# EasyEDA Pro project 蓝牙鼠标.epro

# Schematic 体感式蓝牙鼠标
Board Name: 体感式蓝牙鼠标; Create Date: 2025-04-14; Page Name: P1; Project Name: 空中鼠标; Schematic Name: 体感式蓝牙鼠标; Update Date: 2025-04-24; Company: 嘉立创EDA; Page Size: A4; Version: V1.0
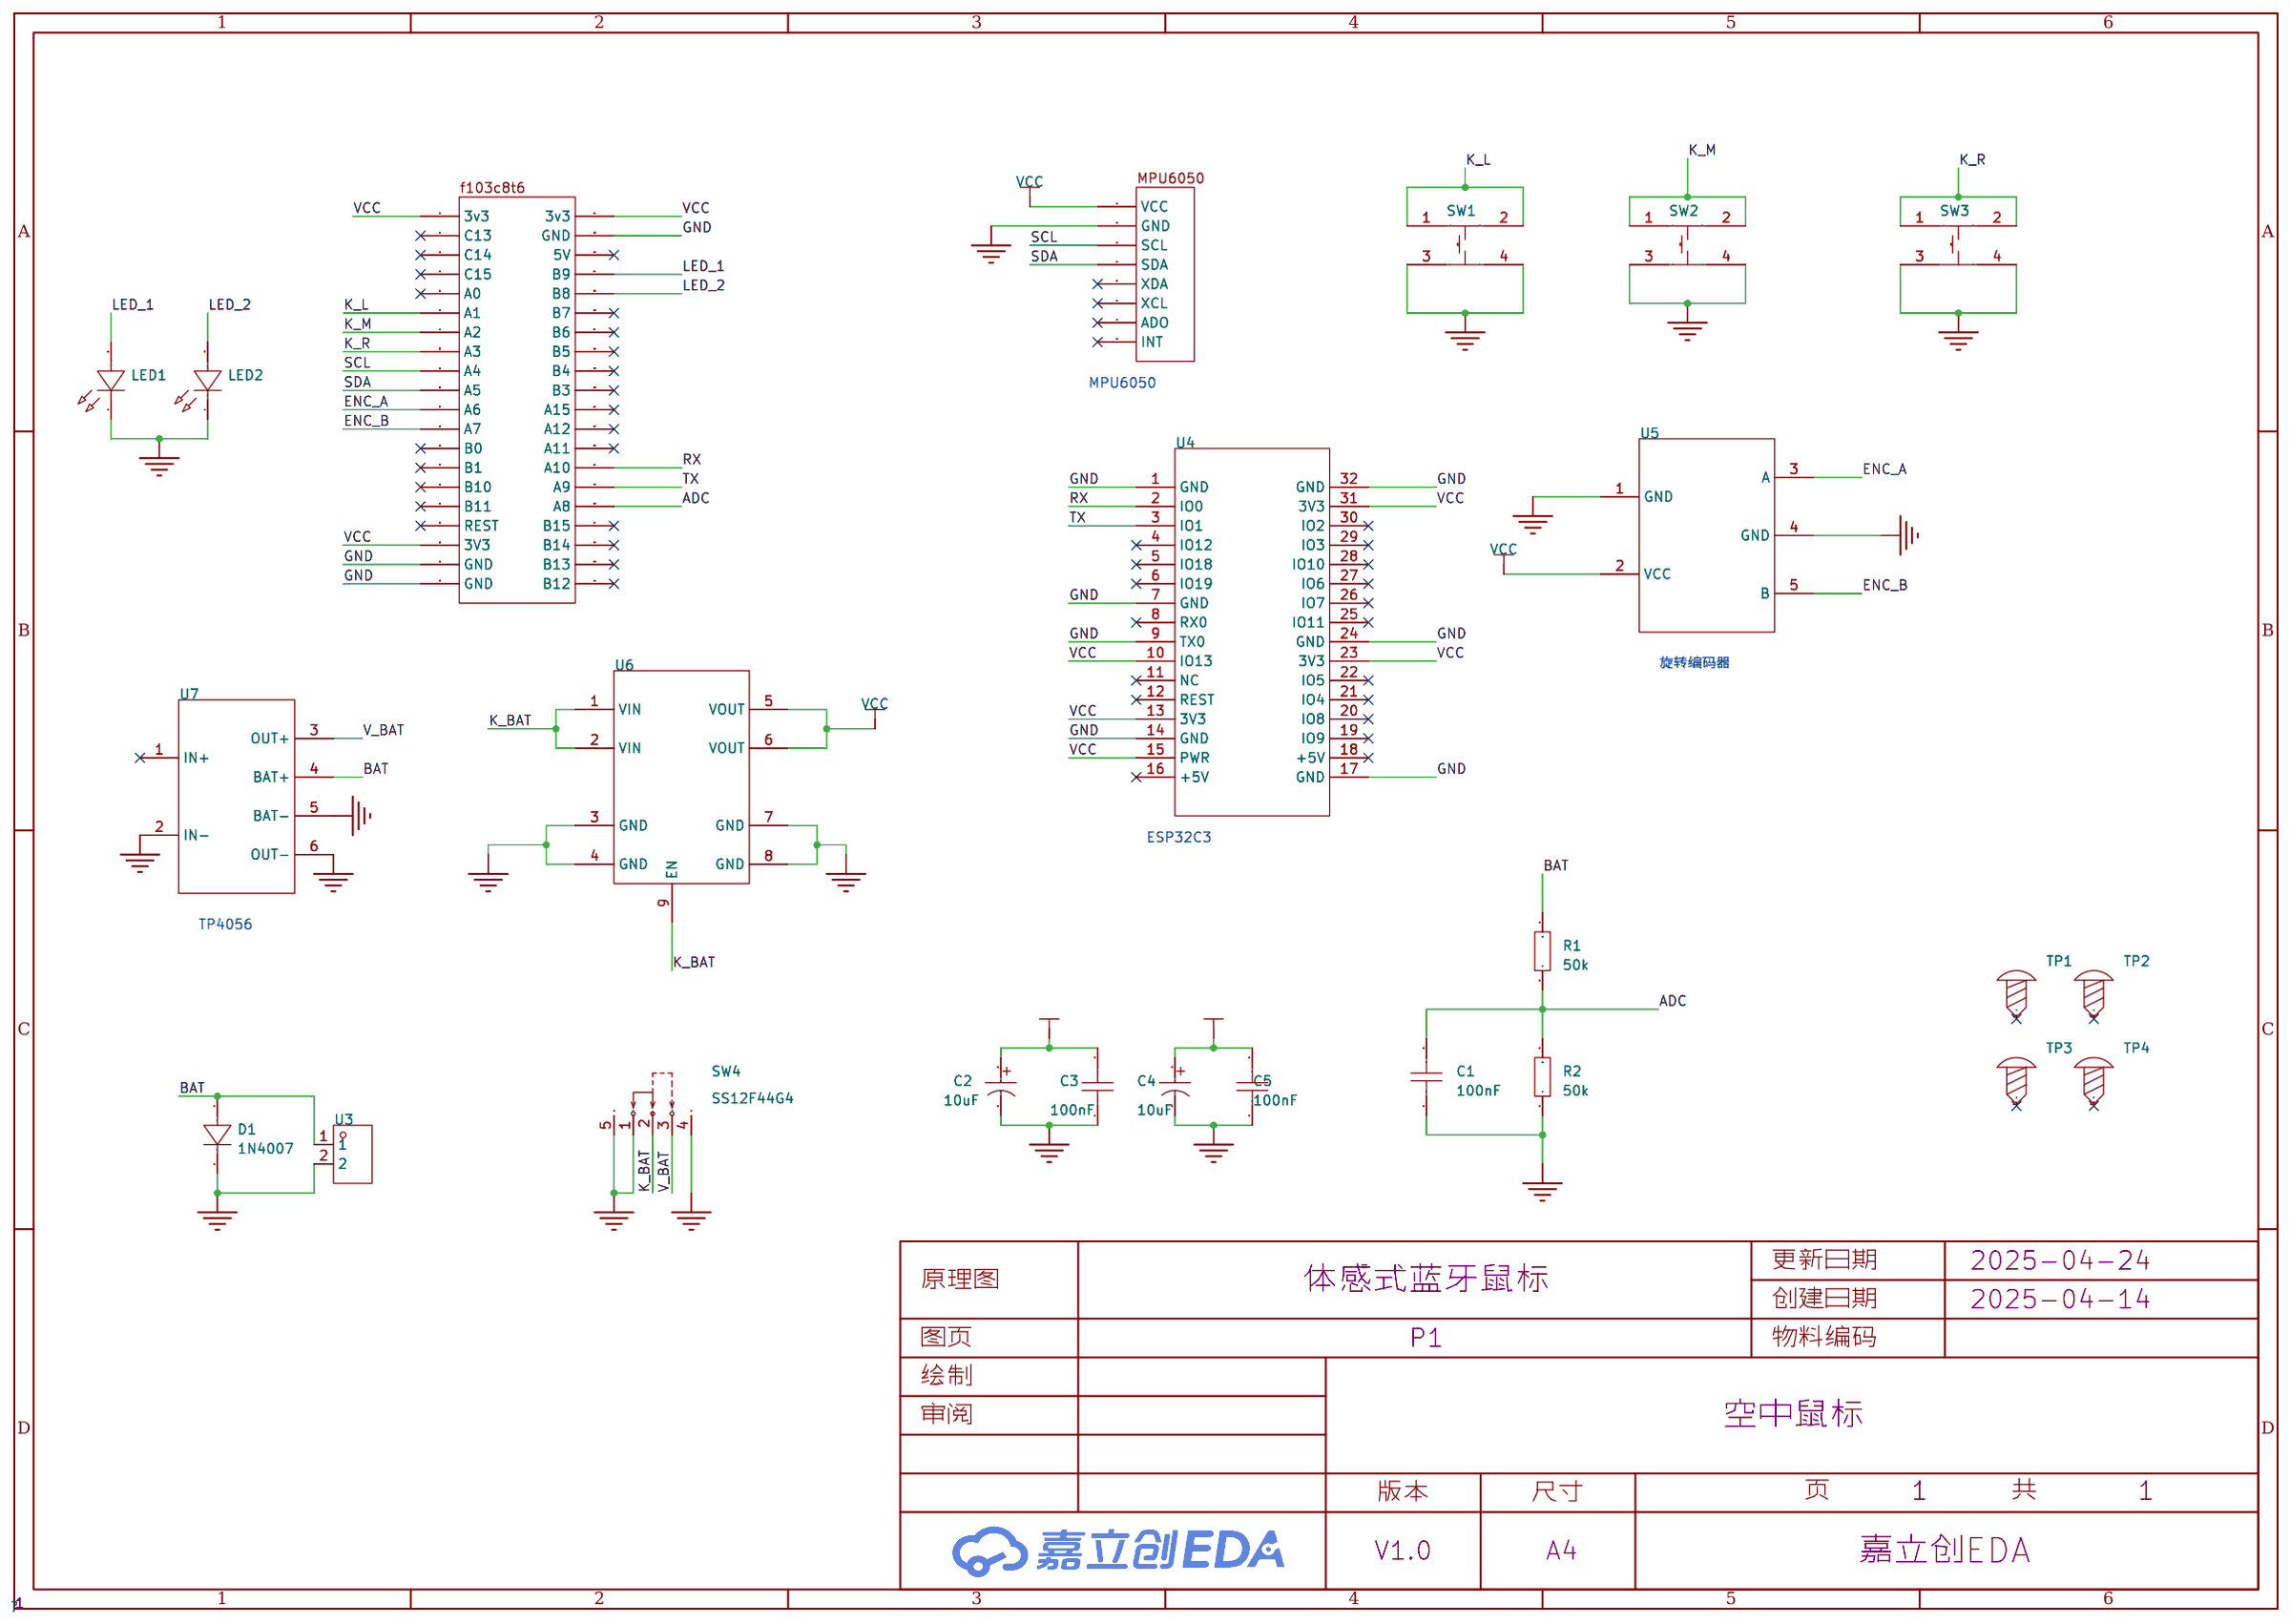
[diagram p0: schematic sheet]

## Parts
C1  100nF  [C0603]
C2  10uF  [CAP-SMD_BD4.0-L4.3-W4.3-FD]
C3  100nF  [C0603]
C4  10uF  [CAP-SMD_BD4.0-L4.3-W4.3-FD]
C5  100nF  [C0603]
D1  1N4007  [SMA_L4.3-W2.5-LS5.0-RD]
LED1  521-9210F  [LED-TH_BD3.0-P2.54-RD]
LED2  521-9210F  [LED-TH_BD3.0-P2.54-RD]
R1  50k  [R0603]
R2  50k  [R0603]
SCREW1  TP1  [M3螺丝]
SCREW2  TP2  [M3螺丝]
SCREW3  TP3  [M3螺丝]
SCREW4  TP4  [M3螺丝]
SW1  TS-1002-07026  [SW-TH_4P-L6.0-W6.0-P4.50-LS6.5]
SW2  TS-1002-07026  [SW-TH_4P-L6.0-W6.0-P4.50-LS6.5]
SW3  TS-1002-07026  [SW-TH_4P-L6.0-W6.0-P4.50-LS6.5]
SW4  SS12F44G4  [SW-TH_SHOU-HAN_SS12F44G4]
U1  -  [stm32f103c8t6最小系统板]
U2  -  [MPU6050]
U3  XY-XHB2.54-2A21  [HDR-TH_2P-P2.50-H-F-W7.3-N]
U4  -  [ESP32C3核心板]
U5  -  [旋转编码器]
U6  -  [TPS63000]
U7  -  [TP4056]

## Library data of the parts
C1 = CAP_0603: Supplier Footprint: 0603
C2 C4 = RVT1V100M0405_C72485: 容值:10uF;精度:±20%;额定电压:35V;纹波电流:15mA@120Hz;等效串联电阻(ESR):-;; LCSC Part Name: 10uF ±20% 35V; Supplier Part: C72485; Manufacturer: ROQANG(容强); Manufacturer Part: RVT1V100M0405; Supplier Footprint: SMD,D4xL5.4mm; JLCPCB Part Class: 扩展库; Datasheet: https://atta.szlcsc.com/upload/public/pdf/source/20170325/1490427950282.pdf; Supplier: LCSC; Tolerance: ±20%; Voltage Rating: 35V; Ripple Current: 15mA@120Hz; Diameter: 4mm; Height - Seated (Max): 5.4mm; Lifetime: 2000hrs@105℃; Operating Temperature: -40℃~+105℃
C3 C5 = CC0603KRX7R9BB104: 容值:100nF;精度:±10%;额定电压:50V;材质(温度系数):X7R;; LCSC Part Name: 100nF ±10% 50V; Supplier Part: C14663; Manufacturer: YAGEO(国巨); Supplier Footprint: 0603; JLCPCB Part Class: 基础库; Datasheet: https://atta.szlcsc.com/upload/public/pdf/source/20180910/C282072_33301C7F631E79921B82A8DAC6BCC5B3.pdf; Supplier: LCSC; Tolerance: ±10%; Voltage Rated: 50V; Temperature Coefficient: X7R
D1 = 1N4007_C727081: 二极管配置:独立式;正向压降(Vf):1.1V@1A;直流反向耐压(Vr):1kV;整流电流:1A;; Supplier Part: C727081; Manufacturer: TWGMC(台湾迪嘉); Supplier Footprint: SMA(DO-214AC); JLCPCB Part Class: 扩展库; Datasheet: https://atta.szlcsc.com/upload/public/pdf/source/20200828/C727079_3A05254382567072883400655AE0ED46.pdf; Supplier: LCSC; Diode Configuration: 独立式; Forward Voltage (Vf@If): 1.1V@1A; Reverse Voltage (Vr): 1kV; Rectified Current: 1A; Reverse Leakage Current (Ir): 5uA
LED1 LED2 = 521-9210F: Supplier Part: C6075075; Manufacturer: Dialight; Supplier Footprint: 插件; Datasheet: https://atta.szlcsc.com/upload/public/pdf/source/20190108/C350939_6833FC1F7AEE099A9F4F0B49B6235C3A.pdf; Supplier: LCSC
R1 R2 = Res_0603: Supplier Footprint: 0603
SCREW1-SCREW4 = M3螺丝: Supplier Footprint: 插件
SW1-SW3 = TS-1002-07026: 电路结构:单刀单掷;按钮形状:圆形按钮;安装方式:直插;开关长度:6mm;开关宽度:6mm;开关高度:7mm;触点电流:50mA;额定电压(DC):12V;带灯:-;机械寿命:-;; LCSC Part Name: 6*6*7mm 直插 轻触开关; Supplier Part: C455095; Manufacturer: XUNPU(讯普); Supplier Footprint: 插件,6x6mm; JLCPCB Part Class: 扩展库; Datasheet: https://atta.szlcsc.com/upload/public/pdf/source/20231108/52BC6409AB52B6746CCC051A15664904.pdf; Supplier: LCSC; Circuit: 单刀单掷; Actuator Style: 圆形按钮; Mounting Style: 直插; Switch Length: 6mm; Switch Width: 6mm; Switch Height: 7mm; Contact Current: 50mA; Voltage Rating (DC): 12V
SW4 = SS12F44G4: 电路结构:单刀双掷;安装方式:直插;开关颜色:-;额定电流(DC):300mA;额定电压(DC):50V;额定电流(AC):-;额定电压(AC):-;机械寿命:5千次;; Supplier Part: C2887261; Manufacturer: SHOU HAN(首韩); Supplier Footprint: 插件; JLCPCB Part Class: 扩展库; Datasheet: https://atta.szlcsc.com/upload/public/pdf/source/20210820/C87A250874D550AF2167CED4FCF38A85.pdf; Supplier: LCSC; Circuit: 单刀双掷; Pin Style: PC引脚; Switch Length: 12mm; Switch Width: 4.5mm; Switch Height: 6mm; Mounting Style: 直插; Current Rating (DC): 300mA; Voltage Rating (DC): 50V; Mechanical Life: 5千次; Operating Temperature: -10℃~+50℃
U1 = stm32f103c8t6最小系统板
U2 = MPU6050
U3 = XY-XHB2.54-2A21: 插针结构:1x2P;间距:2.54mm;安装方式:弯插;总PIN数:2P;排数:1;每排PIN数:2;行距:2.54mm;额定电流:2A;工作温度范围:-25℃~+85℃;; LCSC Part Name: 1x2P 间距:2.54mm 弯插; Supplier Part: C19271395; Manufacturer: XYECONN(辛译); Supplier Footprint: 弯插,P=2.54mm; JLCPCB Part Class: 扩展库; Datasheet: https://atta.szlcsc.com/upload/public/pdf/source/20231124/E581531705911B495C6E735B7C4EA3F8.pdf; Supplier: LCSC; Pins Structure: 1x2P; Pitch: 2.54mm; Mounting Style: 弯插; Number of Pins: 2P; Number of Rows: 1; Number of PINs Per Row: 2; Row Spacing: 2.54mm; Current Rating (Max): 2A; Operating Temperature Range: -25℃~+85℃
U4 = ESP32C3核心板
U5 = 旋转编码器
U6 = TPS63000
U7 = TP4056模块

## Nets
GND: C1.1 C2.2 C3.1 C4.2 C5.1 D1.1(K) LED1.1(K) LED2.1(K) R2.1 SW1.3 SW1.4 SW2.3 SW2.4 SW3.3 SW3.4 SW4.1 SW4.4 SW4.5 U1.19(GND) U1.20(GND) U1.22(GND) U2.2(GND) U3.2 U4.1(GND) U4.7(GND) U4.9(TX0) U4.14(GND) U4.17(GND) U4.24(GND) U4.32(GND) U5.1(GND) U5.4(GND) U6.3(GND) U6.4(GND) U6.7(GND) U6.8(GND) U7.2(IN-) U7.5(BAT-) U7.6(OUT-)
VCC: C4.1 C5.2 U1.1(3v3) U1.18(3V3) U1.21(3v3) U2.1(VCC) U4.10(IO13) U4.13(3V3) U4.15(PWR) U4.23(3V3) U4.31(3V3) U5.2(VCC) U6.5(VOUT) U6.6(VOUT)
ADC: C1.2 R1.1 R2.2 U1.36(A8)
BAT: D1.2(A) R1.2 U3.1 U7.4(BAT+)
ENC_A: U1.11(A6) U5.3(A)
ENC_B: U1.12(A7) U5.5(B)
K_BAT: C2.1 C3.2 SW4.2 U6.1(VIN) U6.2(VIN) U6.9(EN)
K_L: SW1.1 SW1.2 U1.6(A1)
K_M: SW2.1 SW2.2 U1.7(A2)
K_R: SW3.1 SW3.2 U1.8(A3)
LED_1: LED1.2(A) U1.24(B9)
LED_2: LED2.2(A) U1.25(B8)
RX: U1.34(A10) U4.2(IO0)
SCL: U1.9(A4) U2.3(SCL)
SDA: U1.10(A5) U2.4(SDA)
TX: U1.35(A9) U4.3(IO1)
V_BAT: SW4.3 U7.3(OUT+)

Not connected (* = marked no-connect by the designer): SCREW1 1*; SCREW2 1*; SCREW3 1*; SCREW4 1*; U1 2(C13)* 3(C14)* 4(C15)* 5(A0)* 13(B0)* 14(B1)* 15(B10)* 16(B11)* 17(REST)* 23(5V)* 26(B7)* 27(B6)* 28(B5)* 29(B4)* 30(B3)* 31(A15)* 32(A12)* 33(A11)* 37(B15)* 38(B14)* 39(B13)* 40(B12)*; U2 5(XDA)* 6(XCL)* 7(ADO)* 8(INT)*; U4 4(IO12)* 5(IO18)* 6(IO19)* 8(RX0)* 11(NC)* 12(REST)* 16(+5V)* 18(+5V)* 19(IO9)* 20(IO8)* 21(IO4)* 22(IO5)* 25(IO11)* 26(IO7)* 27(IO6)* 28(IO10)* 29(IO3)* 30(IO2)*; U7 1(IN+)*

## Notes on the sheet
- MPU6050
- 旋转编码器
- ESP32C3
- TP4056

# Board PCB2_2
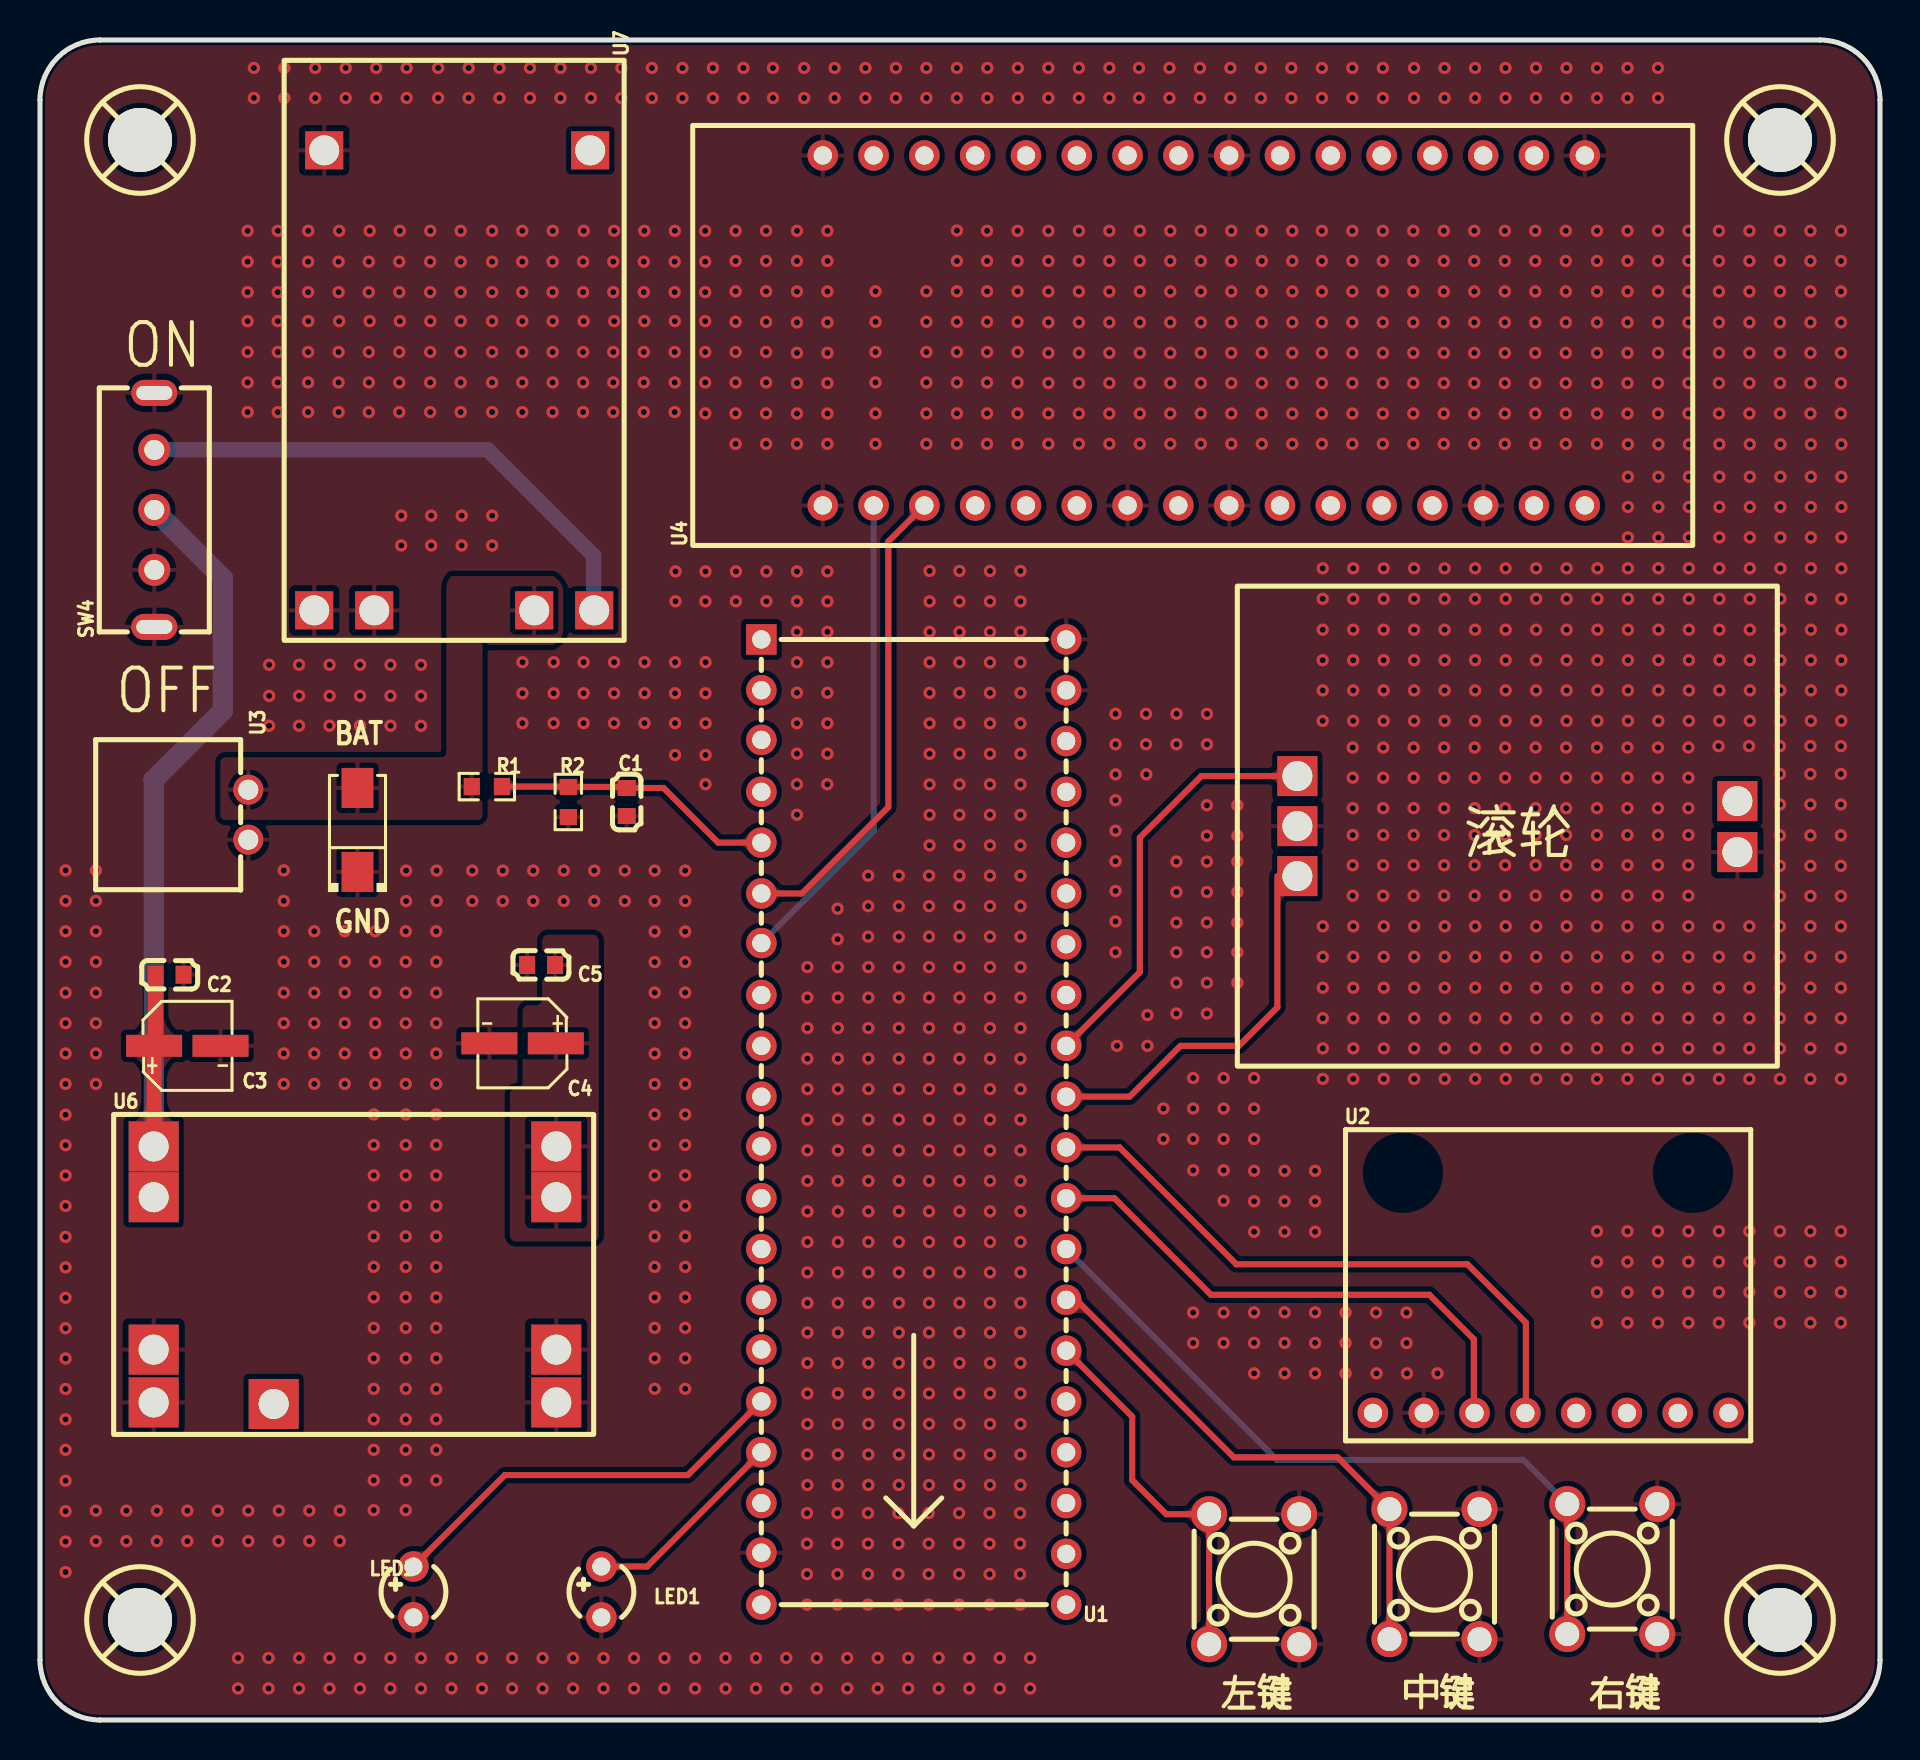
[diagram p1: board, top side]
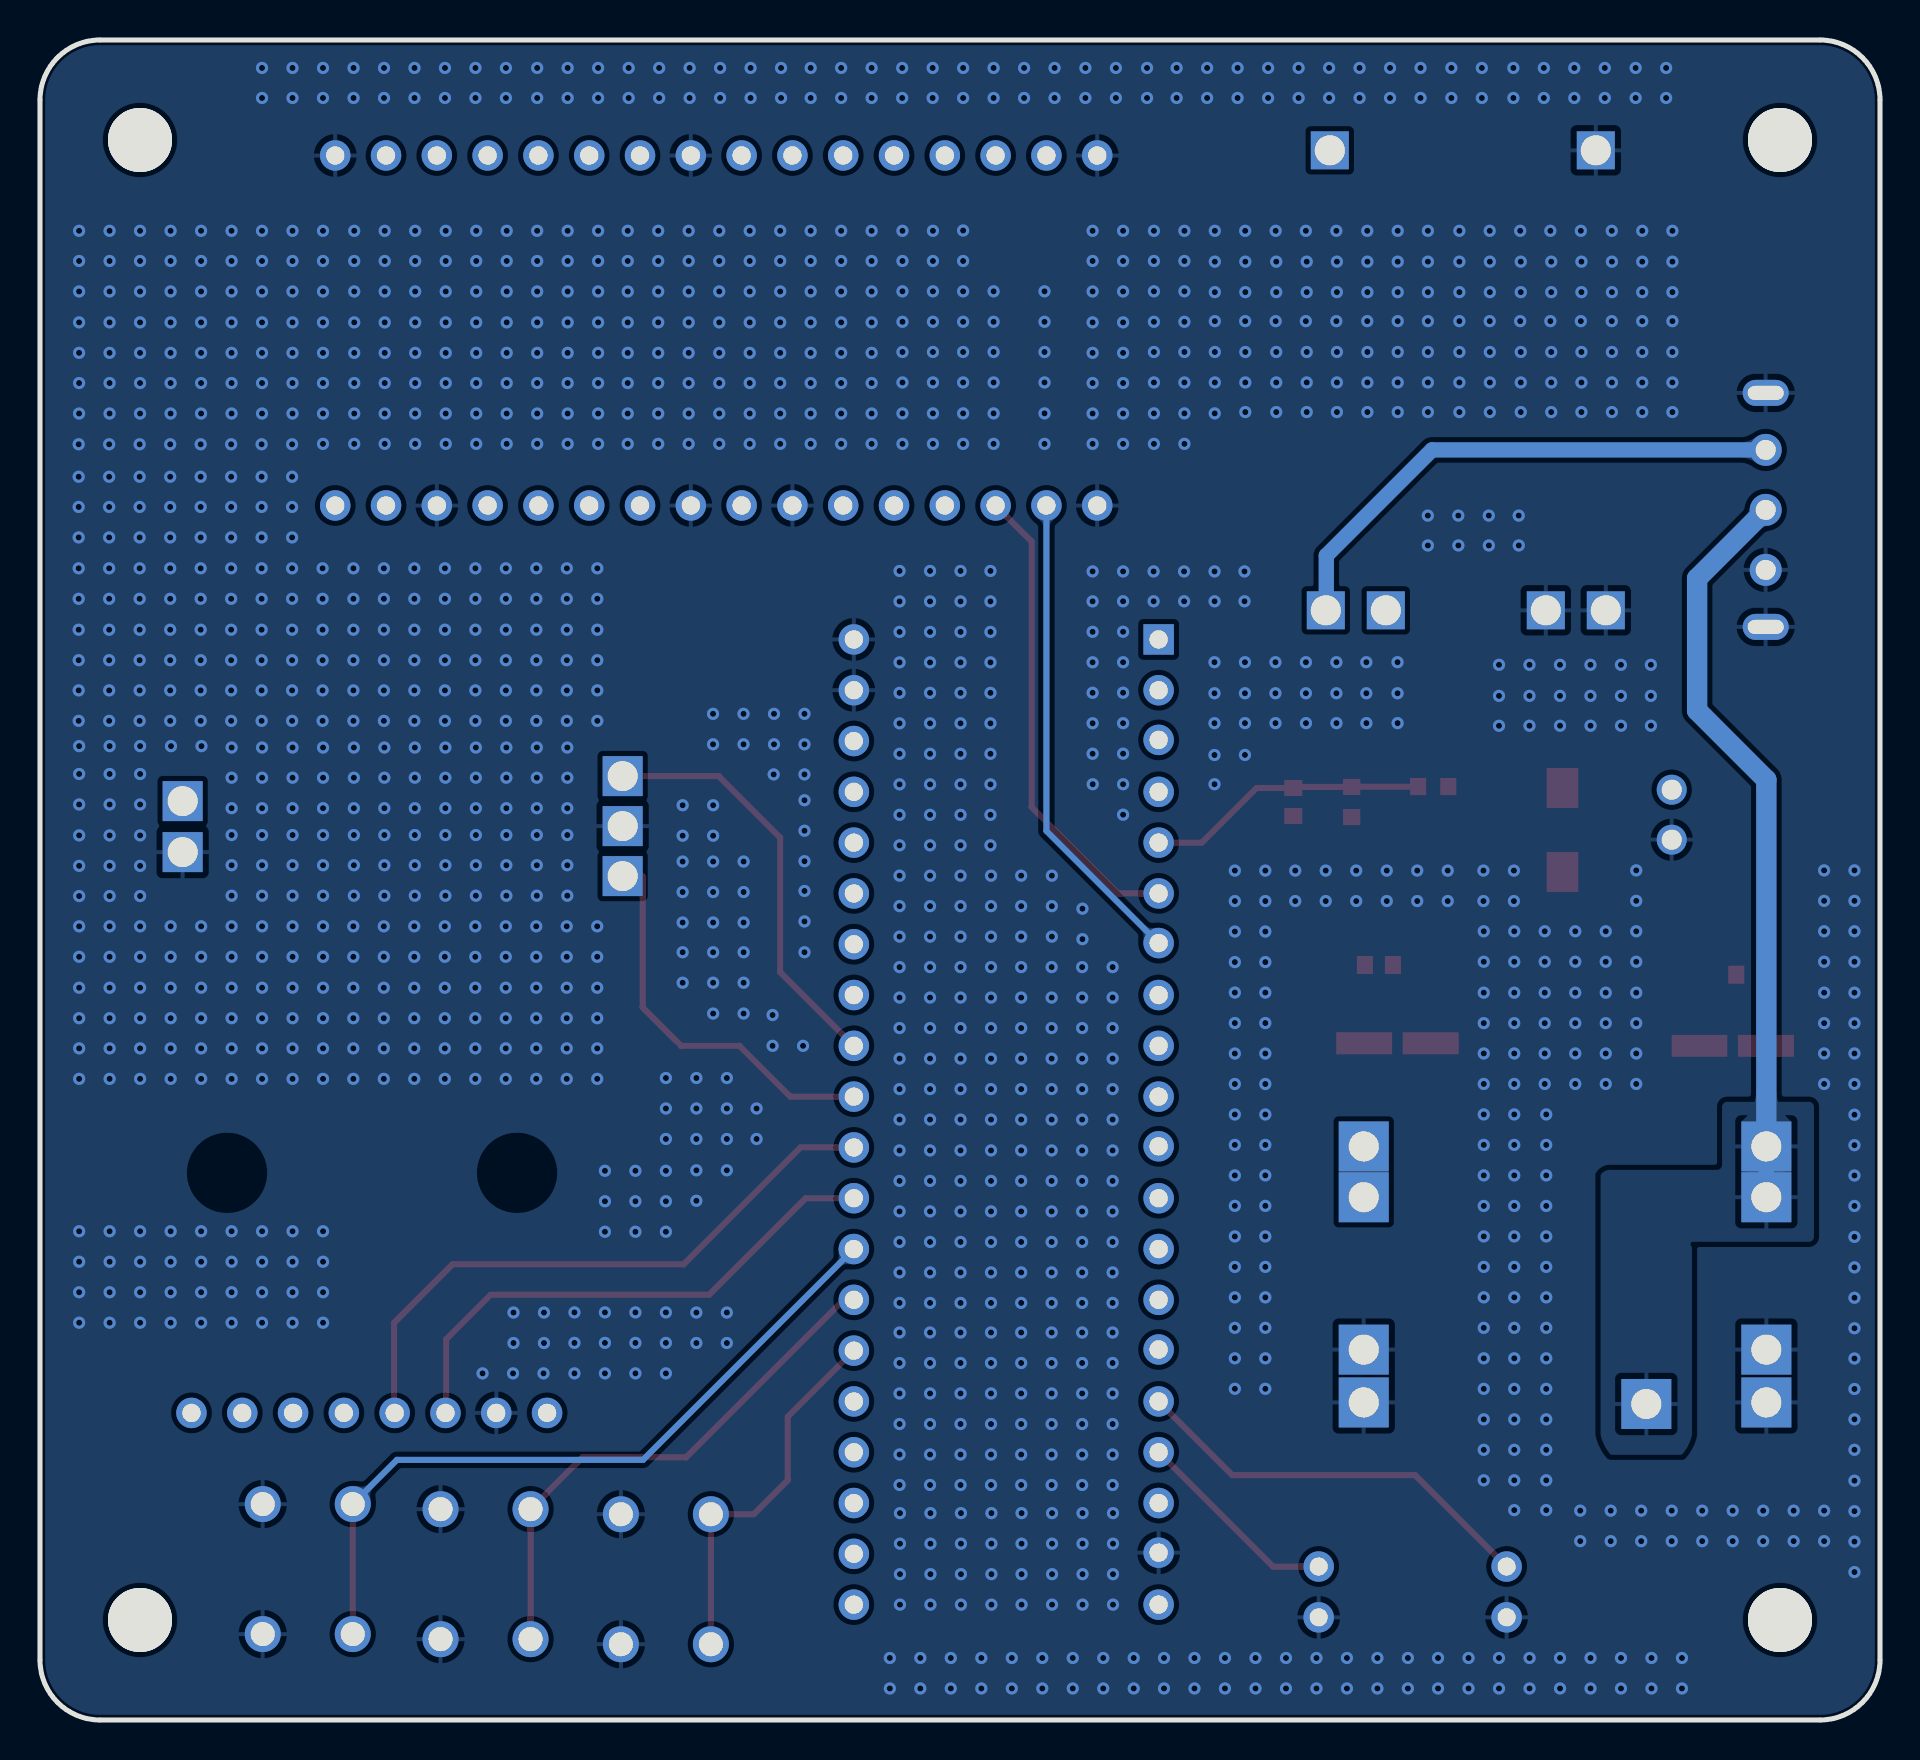
[diagram p2: board, bottom side, seen from below]

Outline 92 x 84 mm; copper layers: Top Layer, Inner1, Inner2, Bottom Layer. Coordinates in mm from the lower left corner of the outline.
Outline path: 0,81 0,3 arc(0.88,0.88) 3,0 89,0 arc(91.12,0.88) 92,3 92,81 arc(91.12,83.12) 89,84 3,84 arc(0.88,83.12) 0,81
Stack: Top Layer 0.035mm 外层铜厚1oz / Dielectric1 0.2104mm 7628 RC49% 8.6mil / Inner1 0.0152mm 内层铜厚 / Dielectric2 1.065mm 1.1mm H/HOZ Copper / Inner2 0.0152mm 内层铜厚 / Dielectric3 0.2104mm 7628 RC49% 8.6mil / Bottom Layer 0.035mm 外层铜厚1oz

## Design rules (mm)
template: 自定义配置
spacing copperThickness1oz (default): track to track 0.102, other pairs 0.152 to 0.3
spacing copperThickness2oz: track to track 0.203, other pairs 0.152 to 0.3
track width copperThickness1oz (default): min 0.127, default 0.305, max 2.54
track width copperThickness2oz: min 0.203, default 0.254, max 2.54
differential pair differentialPair (default): width min 0.127, default 0.254, max 2.54; gap min 0.152, default 0.152
via viaSize (default): diameter min 0.5, default 0.61, max 10; hole min 0.3, default 0.305, max 6.299
net BAT uses copperRegion1

## Placement (name value [footprint] x y rotation side)
C1  100nF  [C0603]  29.34 45.9 90 top
C2  10uF  [CAP-SMD_BD4.0-L4.3-W4.3-FD]  7.37 33.71 0 top
C3  100nF  [C0603]  6.48 37.26 180 top
C4  10uF  [CAP-SMD_BD4.0-L4.3-W4.3-FD]  24.13 33.83 180 top
C5  100nF  [C0603]  25.06 37.75 0 top
D1  1N4007  [SMA_L4.3-W2.5-LS5.0-RD]  15.88 44.5 90 top
LED1  521-9210F  [LED-TH_BD3.0-P2.54-RD]  28.07 6.4 90 top
LED2  521-9210F  [LED-TH_BD3.0-P2.54-RD]  18.67 6.4 90 top
R1  50k  [R0603]  22.34 46.67 180 top
R2  50k  [R0603]  26.42 45.9 90 top
SCREW1  TP1  [M3螺丝]  5 5 270 top
SCREW2  TP2  [M3螺丝]  87 79 270 top
SCREW3  TP3  [M3螺丝]  5 79 270 top
SCREW4  TP4  [M3螺丝]  87 5 270 top
SW1  TS-1002-07026  [SW-TH_4P-L6.0-W6.0-P4.50-LS6.5]  60.71 7.04 90 top
SW2  TS-1002-07026  [SW-TH_4P-L6.0-W6.0-P4.50-LS6.5]  69.72 7.29 90 top
SW3  TS-1002-07026  [SW-TH_4P-L6.0-W6.0-P4.50-LS6.5]  78.61 7.55 90 top
SW4  SS12F44G4  [SW-TH_SHOU-HAN_SS12F44G4]  5.72 60.5 90 top
U1  -  [stm32f103c8t6最小系统板]  51.44 5.9 180 top
U2  -  [MPU6050]  65.28 29.52 0 top
U3  XY-XHB2.54-2A21  [HDR-TH_2P-P2.50-H-F-W7.3-N]  10.41 45.27 270 top
U4  -  [ESP32C3核心板]  32.64 58.73 90 top
U5  -  [旋转编码器]  86.87 56.69 270 top
U6  -  [TPS63000]  3.68 30.28 0 top
U7  -  [TP4056]  29.21 82.98 270 top

## Footprints (pads in the part's own frame, mm; a bottom-side part is the same pattern mirrored in y, then rotated)
C0603
  rect 0.8x0.9 smd: 1(-0.7,0) 2(0.7,0)
CAP-SMD_BD4.0-L4.3-W4.3-FD
  rect 2.8x1.1 smd: 1(-1.661,0) 2(1.661,0)
ESP32C3核心板
  round 1.524 hole 0.914: 1(2,-6.5) 2(2,-9.04) 3(2,-11.58) 4(2,-14.12) 5(2,-16.66) 6(2,-19.2) 7(2,-21.74) 8(2,-24.28) 9(2,-26.82) 10(2,-29.36) 11(2,-31.9) 12(2,-34.44) 13(2,-36.98) 14(2,-39.52) 15(2,-42.06) 16(2,-44.6) 17(19.5,-44.6) 18(19.5,-42.06) 19(19.5,-39.52) 20(19.5,-36.98) 21(19.5,-34.44) 22(19.5,-31.9) 23(19.5,-29.36) 24(19.5,-26.82) 25(19.5,-24.28) 26(19.5,-21.74) 27(19.5,-19.2) 28(19.5,-16.66) 29(19.5,-14.12) 30(19.5,-11.58) 31(19.5,-9.04) 32(19.5,-6.5)
HDR-TH_2P-P2.50-H-F-W7.3-N
  round 1.5 hole 1: 1(-1.25,0) 2(1.25,0)
LED-TH_BD3.0-P2.54-RD
  round 1.524 hole 0.9: 1(-1.27,0) 2(1.27,0)
M3螺丝
  round 3.2 hole 3.2: 1(0,0)
MPU6050
  round 1.524 hole 0.914: 1(1.369,-14.163) 2(3.909,-14.163) 3(6.449,-14.163) 4(8.989,-14.163) 5(11.529,-14.163) 6(14.069,-14.163) 7(16.609,-14.163) 8(19.149,-14.163)
R0603
  rect 0.806x0.864 smd: 1(-0.753,0) 2(0.753,0)
SMA_L4.3-W2.5-LS5.0-RD
  rect 2x1.593 smd: 1(-2.1,0) 2(2.1,0)
stm32f103c8t6最小系统板
  round 1.524 hole 0.914: 1(0.127,0.127) 2(0.127,-2.413) 3(0.127,-4.953) 4(0.127,-7.493) 5(0.127,-10.033) 6(0.127,-12.573) 7(0.127,-15.113) 8(0.127,-17.653) 9(0.127,-20.193) 10(0.127,-22.733) 11(0.127,-25.273) 12(0.127,-27.813) 13(0.127,-30.353) 14(0.127,-32.893) 15(0.127,-35.433) 16(0.127,-37.973) 17(0.127,-40.513) 18(0.127,-43.053) 19(0.127,-45.593) 20(0.127,-48.133) 21(15.367,0.127) 22(15.367,-2.471) 23(15.367,-4.953) 24(15.367,-7.493) 25(15.367,-10.033) 26(15.367,-12.631) 27(15.367,-15.113) 28(15.367,-17.653) 29(15.367,-20.193) 30(15.367,-22.791) 31(15.367,-25.273) 32(15.367,-27.813) 33(15.367,-30.353) 34(15.367,-32.951) 35(15.367,-35.433) 36(15.367,-37.973) 37(15.367,-40.513) 38(15.367,-43.111) 39(15.367,-45.593)
  rect 1.524x1.524 hole 0.914: 40(15.367,-48.133)
SW-TH_4P-L6.0-W6.0-P4.50-LS6.5
  round 1.8 hole 1.2: 1(-3.25,2.25) 2(3.25,2.25) 3(-3.25,-2.25) 4(3.25,-2.25)
SW-TH_SHOU-HAN_SS12F44G4
  round 1.6 hole 1: 1(-3,0) 2(0,0) 3(3,0)
  oval 1.3x2.3 hole 0.7x1.8: 4(5.85,0) 5(-5.85,0)
TP4056
  rect 1.9x1.9 hole 1.5: 1(4.5,-1.7) 2(4.5,-15) 3(27.5,-1.5) 4(27.5,-4.5) 5(27.5,-12.5) 6(27.5,-15.5)
TPS63000
  rect 2.5x2.5 hole 1.5: 1(2,-1.6) 2(2,-4.14) 3(2,-11.76) 4(2,-14.4) 5(22.13,-1.6) 6(22.13,-4.14) 7(22.13,-11.76) 8(22.13,-14.4) 9(8.001,-14.478)
旋转编码器
  rect 2x2 hole 1.5: 1(13.3,-2) 2(10.75,-2) 3(14.5,-24) 4(12,-24) 5(9.5,-24)

## Nets
As in the schematic.

Pads without a net: SCREW1 1; SCREW2 1; SCREW3 1; SCREW4 1; U1 2 3 4 5 13 14 15 16 17 23 26 27 28 29 30 31 32 33 37 38 39 40; U2 5 6 7 8; U4 4 5 6 8 11 12 16 18 19 20 21 22 25 26 27 28 29 30; U7 1

## Via types
v1: diameter 0.61, hole 0.305, Top Layer to Bottom Layer, 1490 vias

## Routing (per net, layer and track width the routed paths; a pad name or vN(x,y) marks a point on that pad's centre or on a via; arc(x,y) is an arc through that point)
GND:
  vias: v1(1.28,42.48) v1(1.28,40.96) v1(1.28,39.44) v1(1.28,37.91) v1(1.28,36.37) v1(1.28,34.84) v1(1.28,33.33) v1(1.28,31.8) v1(1.28,30.27) v1(1.28,28.74) v1(1.28,27.23) v1(1.28,25.7) v1(1.28,24.16) v1(1.28,22.63) v1(1.28,21.11) v1(1.28,19.59) v1(1.28,18.07) v1(1.28,16.55) v1(1.28,15.03) v1(1.28,13.51) v1(1.28,11.97) v1(1.28,10.44) v1(1.28,8.92) v1(1.28,7.4) v1(2.79,42.48) v1(2.79,40.96) v1(2.79,39.44) v1(2.79,37.91) v1(2.79,36.37) v1(2.79,34.84) v1(2.79,33.33) v1(2.79,31.8) v1(2.79,10.47) v1(2.79,8.94) v1(4.32,10.47) v1(4.32,8.94) v1(5.84,10.47) v1(5.84,8.94) v1(7.37,10.47) v1(7.37,8.94) v1(8.89,10.47) v1(8.89,8.94) v1(9.9,3.1) v1(9.9,1.58) v1(10.38,74.46) v1(10.38,72.92) v1(10.38,71.39) v1(10.38,69.94) v1(10.38,68.4) v1(10.38,66.88) v1(10.38,65.4) v1(10.41,10.47) v1(10.41,8.94) v1(10.69,82.6) v1(10.69,81.1) v1(11.43,3.1) v1(11.43,1.58) v1(11.46,52.76) v1(11.46,51.21) v1(11.45,49.71) v1(11.89,74.46) v1(11.89,72.92) v1(11.89,71.39) v1(11.89,69.94) v1(11.89,68.4) v1(11.89,66.88) v1(11.89,65.4) v1(11.94,10.47) v1(11.94,8.94) v1(12.22,82.6) v1(12.22,81.1) v1(12.19,42.48) v1(12.19,40.96) v1(12.19,39.44) v1(12.19,37.91) v1(12.19,36.37) v1(12.19,34.84) v1(12.19,33.33) v1(12.19,31.8) v1(12.95,52.76) v1(12.95,51.21) v1(12.95,49.71) v1(12.95,3.1) v1(12.95,1.58) v1(13.41,74.46) v1(13.41,72.92) v1(13.41,71.39) v1(13.41,69.94) v1(13.41,68.4) v1(13.41,66.88) v1(13.41,65.4) v1(13.47,10.47) v1(13.47,8.94) v1(13.71,39.44) v1(13.71,37.91) v1(13.71,36.37) v1(13.71,34.84) v1(13.71,33.33) v1(13.71,31.8) v1(13.76,82.6) v1(13.76,81.1) v1(14.48,52.76) v1(14.48,51.21) v1(14.47,49.71) v1(14.47,3.1) v1(14.47,1.58) v1(14.93,72.92) v1(14.93,71.39) v1(14.93,68.4) v1(14.93,66.88) v1(14.93,65.4) v1(14.96,74.46) v1(14.96,69.94) v1(14.99,10.47) v1(14.99,8.94) v1(15.24,39.44) v1(15.24,37.91) v1(15.24,36.37) v1(15.24,34.84) v1(15.24,33.33) v1(15.24,31.8) v1(15.28,82.6) v1(15.28,81.1) v1(16,52.76) v1(16,51.21) v1(16,49.71) v1(16,3.1) v1(16,1.58) v1(16.44,72.92) v1(16.44,71.39) v1(16.44,68.4) v1(16.44,66.88) v1(16.44,65.4) v1(16.48,74.46) v1(16.48,69.94) v1(16.69,30.28) v1(16.69,28.75) v1(16.69,27.23) v1(16.69,25.7) v1(16.69,24.18) v1(16.69,22.66) v1(16.69,21.13) v1(16.69,19.61) v1(16.69,18.08) v1(16.69,16.56) v1(16.69,15.03) v1(16.69,13.51) v1(16.69,11.99) v1(16.69,10.49) v1(16.81,82.6) v1(16.81,81.1) v1(16.76,39.44) v1(16.76,37.91) v1(16.76,36.37) v1(16.76,34.84) v1(16.76,33.33) v1(16.76,31.8) v1(17.53,52.76) v1(17.53,51.21) v1(17.53,49.71) v1(17.52,3.1) v1(17.52,1.58) v1(17.99,74.46) v1(17.96,72.92) v1(17.96,71.39) v1(17.99,69.94) v1(17.96,68.4) v1(17.96,66.88) v1(17.96,65.4) v1(18.06,60.22) v1(18.06,58.73) v1(18.33,82.6) v1(18.33,81.1) v1(18.3,42.47) v1(18.3,40.95) v1(18.29,39.44) v1(18.29,37.91) v1(18.29,36.37) v1(18.29,34.84) v1(18.29,33.33) v1(18.29,31.8) v1(18.29,30.28) v1(18.29,28.75) v1(18.29,27.23) v1(18.29,25.7) v1(18.29,24.18) v1(18.29,22.66) v1(18.29,21.13) v1(18.29,19.61) v1(18.29,18.08) v1(18.29,16.56) v1(18.29,15.03) v1(18.29,13.51) v1(18.29,11.99) v1(18.29,10.49) v1(19.05,52.76) v1(19.05,51.21) v1(19.05,49.71) v1(19.05,3.1) v1(19.05,1.58) v1(19.52,74.46) v1(19.51,72.92) v1(19.51,71.39) v1(19.52,69.94) v1(19.51,68.4) v1(19.51,66.88) v1(19.51,65.4) v1(19.56,60.22) v1(19.56,58.73) v1(19.83,42.47) v1(19.83,40.95) v1(19.81,39.44) v1(19.81,37.91) v1(19.81,36.37) v1(19.81,34.84) v1(19.81,33.33) v1(19.81,31.8) v1(19.81,30.28) v1(19.81,28.75) v1(19.81,27.23) v1(19.81,25.7) v1(19.81,24.18) v1(19.81,22.66) v1(19.81,21.13) v1(19.81,19.61) v1(19.81,18.08) v1(19.81,16.56) v1(19.81,15.03) v1(19.81,13.51) v1(19.81,11.99) v1(19.91,82.6) v1(19.91,81.1) v1(20.57,3.1) v1(20.57,1.58) v1(21.03,74.46) v1(21.03,72.92) v1(21.03,71.39) v1(21.03,69.94) v1(21.03,68.4) v1(21.03,66.88) v1(21.03,65.4) v1(21.08,60.22) v1(21.08,58.73) v1(21.43,82.6) v1(21.43,81.1) v1(21.61,42.47) v1(21.61,40.95) v1(22.1,3.1) v1(22.1,1.58) v1(22.61,74.46) v1(22.61,72.92) v1(22.61,71.39) v1(22.61,69.94) v1(22.61,68.4) v1(22.61,66.88) v1(22.61,65.4) v1(22.61,60.22) v1(22.61,58.73) v1(22.97,82.6) v1(22.97,81.1) v1(23.14,42.47) v1(23.14,40.95) v1(23.61,3.1) v1(23.61,1.58) v1(24.11,74.46) v1(24.11,72.92) v1(24.11,71.39) v1(24.11,69.94) v1(24.11,68.4) v1(24.11,66.88) v1(24.11,65.4) v1(24.12,52.89) v1(24.12,51.34) v1(24.12,49.84) v1(24.5,82.6) v1(24.5,81.1) v1(24.66,42.47) v1(24.66,40.95) v1(25.13,3.1) v1(25.13,1.58) v1(25.64,74.46) v1(25.63,72.92) v1(25.63,71.39) v1(25.64,69.94) v1(25.63,68.4) v1(25.63,66.88) v1(25.63,65.4) v1(25.68,52.89) v1(25.68,51.34) v1(25.68,49.84) v1(26.02,82.6) v1(26.02,81.1) v1(26.19,42.47) v1(26.19,40.95) v1(26.65,3.1) v1(26.65,1.58) v1(27.18,74.46) v1(27.16,72.92) v1(27.16,71.39) v1(27.18,69.94) v1(27.16,68.4) v1(27.16,66.88) v1(27.16,65.4) v1(27.18,52.89) v1(27.18,51.34) v1(27.18,49.84) v1(27.55,82.6) v1(27.55,81.1) v1(27.71,42.47) v1(27.71,40.95) v1(28.18,3.1) v1(28.18,1.58) v1(28.71,74.46) v1(28.66,72.92) v1(28.66,71.39) v1(28.71,69.94) v1(28.66,68.4) v1(28.66,66.88) v1(28.66,65.4) v1(28.7,52.89) v1(28.7,51.34) v1(28.7,49.84) v1(29.07,82.6) v1(29.07,81.1) v1(29.24,42.47) v1(29.24,40.95) v1(29.7,3.1) v1(29.7,1.58) v1(30.22,74.46) v1(30.19,72.92) v1(30.19,71.39) v1(30.22,69.94) v1(30.19,68.4) v1(30.19,66.88) v1(30.19,65.4) v1(30.23,52.89) v1(30.23,51.34) v1(30.23,49.84) v1(30.59,82.6) v1(30.59,81.1) v1(30.73,42.47) v1(30.73,40.95) v1(30.73,39.42) v1(30.73,37.9) v1(30.73,36.37) v1(30.73,34.85) v1(30.73,33.32) v1(30.73,31.8) v1(30.73,30.28) v1(30.73,28.75) v1(30.73,27.23) v1(30.73,25.71) v1(30.73,24.18) v1(30.73,22.66) v1(30.73,21.13) v1(30.73,19.61) v1(30.73,18.08) v1(30.73,16.56) v1(31.22,3.1) v1(31.22,1.58) v1(31.74,74.46) v1(31.73,72.92) v1(31.73,71.39) v1(31.74,69.94) v1(31.73,68.4) v1(31.73,66.88) v1(31.73,65.4) v1(31.78,57.43) v1(31.77,55.94) v1(31.75,52.89) v1(31.75,51.34) v1(31.75,49.84) v1(31.75,48.25) v1(32.12,82.6) v1(32.12,81.1) v1(32.26,42.47) v1(32.26,40.95) v1(32.26,39.42) v1(32.26,37.9) v1(32.26,36.37) v1(32.26,34.85) v1(32.26,33.32) v1(32.26,31.8) v1(32.26,30.28) v1(32.26,28.75) v1(32.26,27.23) v1(32.26,25.71) v1(32.26,24.18) v1(32.26,22.66) v1(32.26,21.13) v1(32.26,19.61) v1(32.26,18.08) v1(32.26,16.56) v1(32.75,3.1) v1(32.75,1.58) v1(33.26,74.46) v1(33.26,72.92) v1(33.26,71.39) v1(33.26,69.94) v1(33.26,68.4) v1(33.26,66.88) v1(33.26,65.33) v1(33.27,57.43) v1(33.27,55.94) v1(33.28,52.89) v1(33.28,51.34) v1(33.28,49.84) v1(33.28,48.25) v1(33.27,46.79) v1(33.65,82.6) v1(33.65,81.1) v1(34.28,3.1) v1(34.28,1.58) v1(34.78,74.46) v1(34.78,72.95) v1(34.78,71.43) v1(34.78,69.91) v1(34.78,68.4) v1(34.78,66.88) v1(34.78,65.33) v1(34.78,63.81) v1(34.8,57.43) v1(34.79,55.94) v1(35.17,82.6) v1(35.17,81.1) v1(35.8,3.1) v1(35.8,1.58) v1(36.3,74.46) v1(36.3,72.95) v1(36.3,71.43) v1(36.3,69.91) v1(36.3,68.4) v1(36.3,66.88) v1(36.3,65.33) v1(36.3,63.81) v1(36.32,57.43) v1(36.32,55.94) v1(36.65,82.6) v1(36.65,81.1) v1(37.31,3.1) v1(37.31,1.58) v1(37.85,74.46) v1(37.85,72.95) v1(37.85,71.43) v1(37.85,69.88) v1(37.85,68.36) v1(37.85,66.85) v1(37.85,65.32) v1(37.85,63.81) v1(37.85,57.43) v1(37.85,55.94) v1(37.85,54.41) v1(37.85,52.89) v1(37.85,51.36) v1(37.85,49.84) v1(37.85,48.32) v1(37.85,46.79) v1(37.85,45.27) v1(38.21,82.6) v1(38.21,81.1) v1(38.35,10.34) v1(38.35,8.82) v1(38.35,7.29) v1(38.35,5.77) v1(38.37,37.65) v1(38.37,36.12) v1(38.37,34.6) v1(38.37,33.07) v1(38.37,31.55) v1(38.37,30.02) v1(38.37,28.48) v1(38.37,26.95) v1(38.37,25.43) v1(38.37,23.9) v1(38.37,22.38) v1(38.37,20.85) v1(38.37,19.37) v1(38.37,17.85) v1(38.37,16.33) v1(38.37,14.8) v1(38.37,13.28) v1(38.37,11.75) v1(38.84,3.1) v1(38.84,1.58) v1(39.37,74.46) v1(39.37,72.95) v1(39.37,71.43) v1(39.37,69.88) v1(39.37,68.36) v1(39.37,66.85) v1(39.37,65.32) v1(39.37,63.81) v1(39.37,57.43) v1(39.37,55.93) v1(39.37,54.41) v1(39.37,52.88) v1(39.37,51.36) v1(39.37,49.84) v1(39.37,48.31) v1(39.36,46.79) v1(39.73,82.6) v1(39.73,81.1) v1(39.88,40.57) v1(39.88,39.04) v1(39.89,37.65) v1(39.89,36.12) v1(39.89,34.6) v1(39.89,33.07) v1(39.89,31.55) v1(39.89,30.02) v1(39.89,28.48) v1(39.89,26.95) v1(39.89,25.43) v1(39.89,23.9) v1(39.89,22.38) v1(39.89,20.85) v1(39.89,19.37) v1(39.89,17.85) v1(39.89,16.33) v1(39.89,14.8) v1(39.89,13.28) v1(39.89,11.75) v1(39.87,10.34) v1(39.87,8.82) v1(39.87,7.29) v1(39.87,5.77) v1(40.36,3.1) v1(40.36,1.58) v1(41.27,82.6) v1(41.27,81.1) v1(41.41,42.22) v1(41.41,40.69) v1(41.41,39.17) v1(41.42,37.65) v1(41.42,36.12) v1(41.42,34.6) v1(41.42,33.07) v1(41.42,31.55) v1(41.42,30.02) v1(41.42,28.48) v1(41.42,26.95) v1(41.42,25.43) v1(41.42,23.9) v1(41.42,22.38) v1(41.42,20.85) v1(41.42,19.37) v1(41.42,17.85) v1(41.42,16.33) v1(41.42,14.8) v1(41.42,13.28) v1(41.42,11.75) v1(41.4,10.34) v1(41.4,8.82) v1(41.4,7.29) v1(41.4,5.77) v1(41.77,71.43) v1(41.77,69.91) v1(41.77,68.4) v1(41.77,66.88) v1(41.77,65.33) v1(41.77,63.81) v1(41.89,3.1) v1(41.89,1.58) v1(42.8,82.6) v1(42.8,81.1) v1(42.94,42.22) v1(42.94,40.69) v1(42.94,39.17) v1(42.94,37.65) v1(42.94,36.12) v1(42.94,34.6) v1(42.94,33.07) v1(42.94,31.55) v1(42.94,30.02) v1(42.94,28.48) v1(42.94,26.95) v1(42.94,25.43) v1(42.94,23.9) v1(42.94,22.38) v1(42.94,20.85) v1(42.94,19.37) v1(42.94,17.85) v1(42.94,16.33) v1(42.94,14.8) v1(42.94,13.28) v1(42.94,11.75) v1(42.92,10.34) v1(42.92,8.82) v1(42.92,7.29) v1(42.92,5.77) v1(43.41,3.1) v1(43.41,1.58) v1(44.32,82.6) v1(44.32,81.1) v1(44.32,71.43) v1(44.32,69.91) v1(44.32,68.4) v1(44.32,66.88) v1(44.32,65.33) v1(44.32,63.81) v1(44.45,42.22) v1(44.45,40.69) v1(44.45,39.17) v1(44.45,37.65) v1(44.45,36.12) v1(44.45,34.6) v1(44.45,33.07) v1(44.45,31.55) v1(44.45,30.02) v1(44.45,28.48) v1(44.45,26.95) v1(44.45,25.43) v1(44.45,23.9) v1(44.45,22.38) v1(44.45,20.85) v1(44.45,19.37) v1(44.45,17.85) v1(44.45,16.33) v1(44.45,14.8) v1(44.45,13.28) v1(44.45,11.75) v1(44.43,10.34) v1(44.43,8.82) v1(44.43,7.29) v1(44.43,5.77) v1(44.48,57.45) v1(44.48,55.93) v1(44.48,54.41) v1(44.48,52.88) v1(44.48,51.36) v1(44.48,49.83) v1(44.48,48.31) v1(44.48,46.78) v1(44.48,45.26) v1(44.48,43.73) v1(44.93,3.1) v1(44.93,1.58) v1(45.84,82.6) v1(45.84,81.1) v1(45.84,74.47) v1(45.84,72.95) v1(45.84,71.43) v1(45.84,69.91) v1(45.84,68.4) v1(45.84,66.88) v1(45.84,65.33) v1(45.84,63.81) v1(45.97,57.45) v1(45.97,55.93) v1(45.97,54.41) v1(45.97,52.88) v1(45.97,51.36) v1(45.97,49.83) v1(45.97,48.31) v1(45.97,46.78) v1(45.97,45.26) v1(45.97,43.73) v1(45.97,42.22) v1(45.97,40.69) v1(45.97,39.17) v1(45.97,37.65) v1(45.97,36.12) v1(45.97,34.6) v1(45.97,33.07) v1(45.97,31.55) v1(45.97,30.02) v1(45.97,28.48) v1(45.97,26.95) v1(45.97,25.43) v1(45.97,23.9) v1(45.97,22.38) v1(45.97,20.85) v1(45.97,19.37) v1(45.97,17.85) v1(45.97,16.33) v1(45.97,14.8) v1(45.97,13.28) v1(45.97,11.75) v1(45.95,10.34) v1(45.95,8.82) v1(45.95,7.29) v1(45.95,5.77) v1(46.46,3.1) v1(46.46,1.58) v1(47.37,82.6) v1(47.37,81.1) v1(47.35,74.46) v1(47.35,72.95) v1(47.35,71.43) v1(47.35,69.91) v1(47.35,68.4) v1(47.35,66.88) v1(47.35,65.33) v1(47.35,63.81) v1(47.5,57.45) v1(47.5,55.93) v1(47.5,54.41) v1(47.5,52.88) v1(47.5,51.36) v1(47.5,49.83) v1(47.5,48.31) v1(47.5,46.78) v1(47.5,45.26) v1(47.5,43.73) v1(47.5,42.22) v1(47.5,40.69) v1(47.5,39.17) v1(47.5,37.65) v1(47.5,36.12) v1(47.5,34.6) v1(47.5,33.07) v1(47.5,31.55) v1(47.5,30.02) v1(47.5,28.48) v1(47.5,26.95) v1(47.5,25.43) v1(47.5,23.9) v1(47.5,22.38) v1(47.5,20.85) v1(47.5,19.37) v1(47.5,17.85) v1(47.5,16.33) v1(47.5,14.8) v1(47.5,13.28) v1(47.5,11.75) v1(47.48,10.34) v1(47.48,8.82) v1(47.48,7.29) v1(47.48,5.77) v1(47.98,3.1) v1(47.98,1.58) v1(48.89,82.6) v1(48.89,81.1) v1(48.88,74.46) v1(48.88,72.95) v1(48.88,71.43) v1(48.88,69.91) v1(48.88,68.4) v1(48.88,66.88) v1(48.88,65.33) v1(48.88,63.81) v1(49.02,57.45) v1(49.02,55.93) v1(49.02,54.41) v1(49.02,52.88) v1(49.02,51.36) v1(49.02,49.83) v1(49.02,48.31) v1(49.02,46.78) v1(49.02,45.26) v1(49.02,43.73) v1(49.02,42.22) v1(49.02,40.69) v1(49.02,39.17) v1(49.02,37.65) v1(49.02,36.12) v1(49.02,34.6) v1(49.02,33.07) v1(49.02,31.55) v1(49.02,30.02) v1(49.02,28.48) v1(49.02,26.95) v1(49.02,25.43) v1(49.02,23.9) v1(49.02,22.38) v1(49.02,20.85) v1(49.02,19.37) v1(49.02,17.85) v1(49.02,16.33) v1(49.02,14.8) v1(49.02,13.28) v1(49.02,11.75) v1(49,10.34) v1(49,8.82) v1(49,7.29) v1(49,5.77) v1(49.51,3.1) v1(49.51,1.58) v1(50.42,82.6) v1(50.42,81.1) v1(50.42,74.46) v1(50.42,72.95) v1(50.42,71.43) v1(50.42,69.88) v1(50.42,68.36) v1(50.42,66.85) v1(50.42,65.32) v1(50.42,63.81) v1(51.94,82.6) v1(51.94,81.1) v1(51.94,74.46) v1(51.94,72.95) v1(51.94,71.43) v1(51.94,69.88) v1(51.94,68.36) v1(51.94,66.85) v1(51.94,65.32) v1(51.94,63.81) v1(53.47,82.6) v1(53.47,81.1) v1(53.47,74.46) v1(53.47,72.95) v1(53.47,71.43) v1(53.47,69.88) v1(53.47,68.36) v1(53.47,66.85) v1(53.47,65.32) v1(53.47,63.81) v1(53.78,50.31) v1(53.78,48.78) v1(53.78,47.28) v1(53.78,45.99) v1(53.78,44.46) v1(53.78,42.94) v1(53.78,41.45) v1(53.78,39.93) v1(53.78,38.39) v1(53.85,33.71) v1(54.95,82.6) v1(54.95,81.1) v1(54.99,74.46) v1(54.99,72.95) v1(54.99,71.43) v1(54.99,69.88) v1(54.99,68.36) v1(54.99,66.85) v1(54.99,65.32) v1(54.99,63.81) v1(55.3,50.31) v1(55.3,48.78) v1(55.32,47.28) v1(55.37,35.25) v1(55.37,33.71) v1(56.17,30.58) v1(56.17,29.05) v1(56.47,82.6) v1(56.47,81.1) v1(56.51,74.46) v1(56.51,72.95) v1(56.51,71.43) v1(56.51,69.88) v1(56.51,68.36) v1(56.51,66.85) v1(56.51,65.32) v1(56.51,63.81) v1(56.82,50.31) v1(56.82,48.78) v1(56.82,42.92) v1(56.82,41.4) v1(56.82,39.87) v1(56.82,38.39) v1(56.82,36.86) v1(56.82,35.32) v1(57.66,32.1) v1(57.66,30.58) v1(57.66,29.05) v1(57.66,27.48) v1(57.66,20.37) v1(57.66,18.85) v1(58,82.6) v1(58,81.1) v1(58.04,74.46) v1(58.04,72.95) v1(58.04,71.43) v1(58.04,69.88) v1(58.04,68.36) v1(58.04,66.85) v1(58.04,65.32) v1(58.04,63.81) v1(58.35,50.31) v1(58.35,48.78) v1(58.34,45.74) v1(58.34,44.22) v1(58.34,42.92) v1(58.34,41.4) v1(58.34,39.87) v1(58.34,38.39) v1(58.34,36.86) v1(58.34,35.32) v1(59.18,32.1) v1(59.18,30.58) v1(59.18,29.05) v1(59.18,27.48) v1(59.18,25.96) v1(59.18,20.37) v1(59.18,18.85) v1(59.52,82.6) v1(59.52,81.1) v1(59.57,74.46) v1(59.57,72.95) v1(59.57,71.43) v1(59.57,69.88) v1(59.57,68.36) v1(59.57,66.85) v1(59.57,65.32) v1(59.57,63.81) v1(59.87,45.74) v1(59.87,44.22) v1(59.87,42.92) v1(59.87,41.4) v1(59.87,39.87) v1(59.87,38.39) v1(59.87,36.86) v1(60.71,32.1) v1(60.71,30.58) v1(60.71,29.05) v1(60.71,27.46) v1(60.71,25.94) v1(60.71,24.41) v1(60.71,20.38) v1(60.71,18.86) v1(60.71,17.33) v1(61.04,82.6) v1(61.04,81.1) v1(61.09,74.46) v1(61.09,72.95) v1(61.09,71.43) v1(61.09,69.88) v1(61.09,68.36) v1(61.09,66.85) v1(61.09,65.32) v1(61.09,63.81) v1(62.23,27.46) v1(62.23,25.94) v1(62.23,24.41) v1(62.23,20.38) v1(62.23,18.86) v1(62.23,17.33) v1(62.57,82.6) v1(62.57,81.1) v1(62.61,74.46) v1(62.61,72.95) v1(62.61,71.43) v1(62.61,69.88) v1(62.61,68.36) v1(62.61,66.85) v1(62.61,65.32) v1(62.61,63.81) v1(63.75,27.46) v1(63.75,25.94) v1(63.75,24.41) v1(63.75,20.38) v1(63.75,18.86) v1(63.75,17.33) v1(64.09,82.6) v1(64.09,81.1) v1(64.09,74.46) v1(64.09,72.95) v1(64.09,71.43) v1(64.09,69.88) v1(64.09,68.36) v1(64.09,66.85) v1(64.09,65.32) v1(64.09,63.81) v1(64.13,57.58) v1(64.13,56.06) v1(64.13,54.51) v1(64.13,52.99) v1(64.13,51.48) v1(64.13,49.96) v1(64.14,39.68) v1(64.14,38.16) v1(64.14,36.61) v1(64.14,35.09) v1(64.14,33.58) v1(64.14,32.06) v1(65.28,20.38) v1(65.28,18.86) v1(65.28,17.33) v1(65.62,82.6) v1(65.62,81.1) v1(65.62,74.46) v1(65.62,72.95) v1(65.62,71.43) v1(65.62,69.88) v1(65.62,68.36) v1(65.62,66.85) v1(65.62,65.32) v1(65.62,63.81) v1(65.64,48.62) v1(65.64,47.11) v1(65.64,45.59) v1(65.64,44.25) v1(65.64,42.74) v1(65.64,41.22) v1(65.66,57.58) v1(65.66,56.06) v1(65.66,54.51) v1(65.66,52.99) v1(65.66,51.48) v1(65.66,49.96) v1(65.66,39.68) v1(65.66,38.16) v1(65.66,36.61) v1(65.66,35.09) v1(65.66,33.58) v1(65.66,32.06) v1(66.8,20.37) v1(66.8,18.85) v1(66.82,17.33) v1(67.14,82.6) v1(67.14,81.1) v1(67.14,74.46) v1(67.14,72.95) v1(67.14,71.43) v1(67.14,69.88) v1(67.14,68.36) v1(67.14,66.85) v1(67.14,65.32) v1(67.14,63.81) v1(67.18,57.58) v1(67.18,56.06) v1(67.18,54.51) v1(67.18,52.99) v1(67.18,51.48) v1(67.18,49.96) v1(67.16,48.62) v1(67.16,47.11) v1(67.16,45.59) v1(67.16,44.25) v1(67.16,42.74) v1(67.16,41.22) v1(67.19,39.68) v1(67.19,38.16) v1(67.19,36.61) v1(67.19,35.09) v1(67.19,33.58) v1(67.19,32.06) v1(68.33,20.37) v1(68.33,18.85) v1(68.35,17.33) v1(68.7,82.6) v1(68.7,81.1) v1(68.67,74.46) v1(68.67,72.95) v1(68.67,71.43) v1(68.67,69.88) v1(68.67,68.36) v1(68.67,66.85) v1(68.67,65.32) v1(68.67,63.81) v1(68.71,57.58) v1(68.71,56.06) v1(68.71,54.51) v1(68.71,52.99) v1(68.71,51.48) v1(68.71,49.96) v1(68.68,48.62) v1(68.68,47.11) v1(68.68,45.59) v1(68.68,44.25) v1(68.68,42.74) v1(68.68,41.22) v1(68.71,39.68) v1(68.71,38.16) v1(68.71,36.61) v1(68.71,35.09) v1(68.71,33.58) v1(68.71,32.06) v1(69.87,17.33) v1(70.23,82.6) v1(70.23,81.1) v1(70.19,74.46) v1(70.19,72.95) v1(70.19,71.43) v1(70.19,69.88) v1(70.19,68.36) v1(70.19,66.85) v1(70.19,65.32) v1(70.19,63.81) v1(70.23,57.58) v1(70.23,56.06) v1(70.23,54.51) v1(70.23,52.99) v1(70.23,51.48) v1(70.23,49.96) v1(70.21,48.62) v1(70.21,47.11) v1(70.21,45.59) v1(70.21,44.25) v1(70.21,42.74) v1(70.21,41.22) v1(70.24,39.68) v1(70.24,38.16) v1(70.24,36.61) v1(70.24,35.09) v1(70.24,33.58) v1(70.24,32.06) v1(71.71,74.46) v1(71.71,72.95) v1(71.71,71.43) v1(71.71,69.88) v1(71.71,68.36) v1(71.71,66.85) v1(71.71,65.32) v1(71.71,63.81) v1(71.73,48.62) v1(71.73,47.11) v1(71.73,45.59) v1(71.73,44.25) v1(71.73,42.74) v1(71.73,41.22) v1(71.75,82.6) v1(71.75,81.1) v1(71.75,57.58) v1(71.75,56.06) v1(71.75,54.51) v1(71.75,52.99) v1(71.75,51.48) v1(71.75,49.96) v1(71.76,39.68) v1(71.76,38.16) v1(71.76,36.61) v1(71.76,35.09) v1(71.76,33.58) v1(71.76,32.06) v1(73.24,74.46) v1(73.24,72.95) v1(73.24,71.43) v1(73.24,69.88) v1(73.24,68.36) v1(73.24,66.85) v1(73.24,65.32) v1(73.24,63.81) v1(73.28,82.6) v1(73.28,81.1) v1(73.28,57.58) v1(73.28,56.06) v1(73.28,54.51) v1(73.28,52.99) v1(73.28,51.48) v1(73.28,49.96) v1(73.26,48.62) v1(73.26,47.11) v1(73.26,45.59) v1(73.26,44.25) v1(73.26,42.74) v1(73.26,41.22) v1(73.29,39.68) v1(73.29,38.16) v1(73.29,36.61) v1(73.29,35.09) v1(73.29,33.58) v1(73.29,32.06) v1(74.8,82.6) v1(74.8,81.1) v1(74.76,74.46) v1(74.76,72.95) v1(74.76,71.43) v1(74.76,69.88) v1(74.76,68.36) v1(74.76,66.85) v1(74.76,65.32) v1(74.76,63.81) v1(74.81,57.58) v1(74.81,56.06) v1(74.81,54.51) v1(74.81,52.99) v1(74.81,51.48) v1(74.81,49.96) v1(74.78,48.62) v1(74.78,47.11) v1(74.78,45.59) v1(74.78,44.25) v1(74.78,42.74) v1(74.78,41.22) v1(74.81,39.68) v1(74.81,38.16) v1(74.81,36.61) v1(74.81,35.09) v1(74.81,33.58) v1(74.81,32.06) v1(76.32,82.6) v1(76.32,81.1) v1(76.29,74.46) v1(76.29,72.95) v1(76.29,71.43) v1(76.29,69.88) v1(76.29,68.36) v1(76.29,66.85) v1(76.29,65.32) v1(76.29,63.81) v1(76.33,57.58) v1(76.33,56.06) v1(76.33,54.51) v1(76.33,52.99) v1(76.33,51.48) v1(76.33,49.96) v1(76.31,48.62) v1(76.31,47.11) v1(76.31,45.59) v1(76.31,44.25) v1(76.31,42.74) v1(76.31,41.22) v1(76.33,39.68) v1(76.33,38.16) v1(76.33,36.61) v1(76.33,35.09) v1(76.33,33.58) v1(76.33,32.06) v1(77.85,48.62) v1(77.85,47.11) v1(77.85,45.59) v1(77.85,44.25) v1(77.85,42.74) v1(77.85,41.22) v1(77.85,39.68) v1(77.85,38.16) v1(77.85,36.61) v1(77.85,35.09) v1(77.85,33.58) v1(77.85,32.06) v1(77.85,24.44) v1(77.85,22.91) v1(77.85,21.39) v1(77.85,19.86) v1(77.85,82.6) v1(77.85,81.1) v1(77.85,74.46) v1(77.85,72.95) v1(77.85,71.43) v1(77.85,69.88) v1(77.85,68.36) v1(77.85,66.85) v1(77.85,65.32) v1(77.85,63.81) v1(77.87,57.58) v1(77.87,56.06) v1(77.87,54.51) v1(77.87,52.99) v1(77.87,51.48) v1(77.87,49.96) v1(79.38,82.6) v1(79.38,81.1) v1(79.38,74.46) v1(79.38,72.95) v1(79.38,71.43) v1(79.38,69.88) v1(79.38,68.36) v1(79.38,66.85) v1(79.38,65.32) v1(79.4,63.79) v1(79.4,62.16) v1(79.4,60.65) v1(79.4,59.13) v1(79.4,57.58) v1(79.4,56.06) v1(79.4,54.51) v1(79.4,52.99) v1(79.4,51.48) v1(79.4,49.96) v1(79.37,48.62) v1(79.37,47.11) v1(79.37,45.59) v1(79.37,44.25) v1(79.37,42.74) v1(79.37,41.22) v1(79.37,39.68) v1(79.37,38.16) v1(79.37,36.61) v1(79.37,35.09) v1(79.37,33.58) v1(79.37,32.06) v1(79.37,24.44) v1(79.37,22.91) v1(79.37,21.39) v1(79.37,19.86) v1(80.9,82.6) v1(80.9,81.1) v1(80.9,74.46) v1(80.9,72.95) v1(80.9,71.43) v1(80.9,69.88) v1(80.9,68.36) v1(80.9,66.85) v1(80.9,65.32) v1(80.92,63.79) v1(80.92,62.16) v1(80.92,60.65) v1(80.92,59.13) v1(80.92,57.58) v1(80.92,56.06) v1(80.92,54.51) v1(80.92,52.99) v1(80.92,51.48) v1(80.92,49.96) v1(80.9,48.62) v1(80.9,47.11) v1(80.9,45.59) v1(80.9,44.25) v1(80.9,42.74) v1(80.9,41.22) v1(80.9,39.68) v1(80.9,38.16) v1(80.9,36.61) v1(80.9,35.09) v1(80.9,33.58) v1(80.9,32.06) v1(80.9,24.44) v1(80.9,22.91) v1(80.9,21.39) v1(80.9,19.86) v1(82.42,74.46) v1(82.42,72.95) v1(82.42,71.43) v1(82.42,69.88) v1(82.42,68.36) v1(82.42,66.85) v1(82.42,65.32) v1(82.44,63.79) v1(82.44,62.16) v1(82.44,60.65) v1(82.44,59.13) v1(82.44,57.58) v1(82.44,56.06) v1(82.44,54.51) v1(82.44,52.99) v1(82.44,51.48) v1(82.44,49.96) v1(82.42,48.62) v1(82.42,47.11) v1(82.42,45.59) v1(82.42,44.25) v1(82.42,42.74) v1(82.42,41.22) v1(82.42,39.68) v1(82.42,38.16) v1(82.42,36.61) v1(82.42,35.09) v1(82.42,33.58) v1(82.42,32.06) v1(82.42,24.44) v1(82.42,22.91) v1(82.42,21.39) v1(82.42,19.86) v1(83.95,74.46) v1(83.95,72.95) v1(83.95,71.43) v1(83.95,69.88) v1(83.95,68.36) v1(83.95,66.85) v1(83.95,65.32) v1(83.93,48.69) v1(83.94,39.68) v1(83.94,38.16) v1(83.94,36.61) v1(83.94,35.09) v1(83.94,33.58) v1(83.94,32.06) v1(83.94,24.44) v1(83.94,22.91) v1(83.94,21.39) v1(83.94,19.86) v1(83.97,63.79) v1(83.97,62.16) v1(83.97,60.65) v1(83.97,59.13) v1(83.97,57.58) v1(83.97,56.06) v1(83.97,54.51) v1(83.97,52.99) v1(83.97,51.48) v1(83.97,49.96) v1(85.47,74.46) v1(85.47,72.95) v1(85.47,71.43) v1(85.47,69.88) v1(85.47,68.36) v1(85.47,66.85) v1(85.47,65.32) v1(85.49,63.79) v1(85.49,62.16) v1(85.49,60.65) v1(85.49,59.13) v1(85.49,57.58) v1(85.49,56.06) v1(85.49,54.51) v1(85.49,52.99) v1(85.49,51.48) v1(85.49,49.96) v1(85.45,48.69) v1(85.47,39.68) v1(85.47,38.16) v1(85.47,36.61) v1(85.47,35.09) v1(85.47,33.58) v1(85.47,32.06) v1(85.47,24.44) v1(85.47,22.91) v1(85.47,21.39) v1(85.47,19.86) v1(87,74.46) v1(87,72.95) v1(87,71.43) v1(87,69.88) v1(87,68.36) v1(87,66.85) v1(87,65.32) v1(87.02,63.79) v1(87.02,62.16) v1(87.02,60.65) v1(87.02,59.13) v1(87.02,57.58) v1(87.02,56.06) v1(87.02,54.51) v1(87.02,52.99) v1(87.02,51.48) v1(87.02,49.96) v1(87,48.69) v1(87,47.3) v1(87,45.78) v1(87,44.23) v1(87,42.71) v1(87,41.2) v1(87,39.68) v1(87,38.16) v1(87,36.61) v1(87,35.09) v1(87,33.58) v1(87,32.06) v1(87,24.44) v1(87,22.91) v1(87,21.39) v1(87,19.86) v1(88.52,74.46) v1(88.52,72.95) v1(88.52,71.43) v1(88.52,69.88) v1(88.52,68.36) v1(88.52,66.85) v1(88.52,65.32) v1(88.54,63.79) v1(88.54,62.16) v1(88.54,60.65) v1(88.54,59.13) v1(88.54,57.58) v1(88.54,56.06) v1(88.54,54.51) v1(88.54,52.99) v1(88.54,51.48) v1(88.54,49.96) v1(88.52,48.69) v1(88.52,47.3) v1(88.52,45.78) v1(88.52,44.23) v1(88.52,42.71) v1(88.52,41.2) v1(88.52,39.68) v1(88.52,38.16) v1(88.52,36.61) v1(88.52,35.09) v1(88.52,33.58) v1(88.52,32.06) v1(88.52,24.44) v1(88.52,22.91) v1(88.52,21.39) v1(88.52,19.86) v1(90.05,74.46) v1(90.05,72.95) v1(90.05,71.43) v1(90.05,69.88) v1(90.05,68.36) v1(90.05,66.85) v1(90.05,65.32) v1(90.04,48.69) v1(90.04,47.3) v1(90.04,45.78) v1(90.04,44.23) v1(90.04,42.71) v1(90.04,41.2) v1(90.04,39.68) v1(90.04,38.16) v1(90.04,36.61) v1(90.04,35.09) v1(90.04,33.58) v1(90.04,32.06) v1(90.04,24.44) v1(90.04,22.91) v1(90.04,21.39) v1(90.04,19.86) v1(90.07,63.79) v1(90.07,62.16) v1(90.07,60.65) v1(90.07,59.13) v1(90.07,57.58) v1(90.07,56.06) v1(90.07,54.51) v1(90.07,52.99) v1(90.07,51.48) v1(90.07,49.96)
ADC: length 14.1
  Top Layer w0.305: U1.36 33.91,43.87 31.18,46.6 C1.2 29.28,46.65 R2.2 26.4,46.67 23.1,46.67
ENC_A: length 19
  Top Layer w0.305: U1.11 54.48,31.17 57.02,33.71 59.94,33.71 61.87,35.63 61.87,42.19
ENC_B: length 20.1
  Top Layer w0.305: U1.12 54.99,37.39 54.99,44.12 58.06,47.19 61.87,47.19
K_BAT: length 45.8
  Top Layer w0.762: C3.2 5.78,33.78 C2.1 5.71,28.7 U6.1
  Bottom Layer w0.762: U6.1 U6.2
  Bottom Layer w1.016: SW4.2 9.14,57.08 9.14,50.47 5.68,47.01 U6.1
K_L: length 18.9
  Top Layer w0.305: U1.6 54.61,15.17 54.61,11.99 56.31,10.29 SW1.2 SW1.1
K_M: length 27
  Top Layer w0.305: SW2.1 SW2.2 64.88,13.13 59.69,13.13 51.82,21.01 U1.7
K_R: length 36.8
  Top Layer w0.305: SW3.2 SW3.1
  Bottom Layer w0.305: U1.8 61.85,13.01 74.15,13.01 SW3.2
LED_1: length 10.4
  Top Layer w0.305: U1.24 30.35,7.67 LED1.2
LED_2: length 20.8
  Top Layer w0.305: U1.25 32.38,12.25 23.24,12.25 LED2.2
RX: length 24.2
  Bottom Layer w0.305: U1.34 41.68,44.46 U4.2
SCL: length 27
  Top Layer w0.305: U1.9 53.72,26.09 58.55,21.26 69.47,21.26 71.69,19.04 71.69,15.39 U2.3
SDA: length 31.1
  Top Layer w0.305: U1.10 53.97,28.63 59.82,22.79 71.37,22.79 74.29,19.86 74.29,15.38 U2.4
TX: length 24
  Top Layer w0.305: U4.3 42.42,58.93 42.42,45.65 38.1,41.33 U1.35
V_BAT: length 26.9
  Bottom Layer w0.762: SW4.3 22.4,63.5 27.69,58.22 27.69,55.51 U7.3

## Copper pours and planes (outline as drawn; the poured copper is in the pictures)
GND on Top Layer: -13.84,86.54 106.3,86.54 106.3,-4.39 -13.84,-4.39
GND on Bottom Layer: -10.67,87.81 99.95,87.81 99.95,-5.41 -10.67,-5.41
GND on Inner1: 0.26,83.74 91.74,83.74 91.74,0.26 0.26,0.26
VCC on Top Layer: 27.64,39.27 27.85,39.18 27.94,38.96 27.94,24.23 27.85,24.02 27.64,23.93 23.8,23.93 23.58,24.02 23.5,24.23 23.5,31.28 23.58,31.49 23.8,31.58 23.83,31.58 24.04,31.67 24.13,31.89 24.13,35.43 24.22,35.65 24.44,35.74 24.81,35.74 25.02,35.83 25.11,36.04 25.11,38.96 25.2,39.18 25.42,39.27
VCC on Inner2: 0.26,83.74 91.74,83.74 91.74,0.26 0.26,0.26
BAT on Top Layer: 21.87,45 22.05,45.07 22.12,45.25 22.12,53.87 22.29,53.88 22.38,53.75 25.65,53.75 25.97,54.02 26.16,54.38 26.16,56.57 25.97,56.93 25.65,57.2 20.57,57.2 20.38,56.91 20.32,56.57 20.32,48.39 20.25,48.21 20.07,48.14 9.27,48.14 9.09,48.07 9.02,47.89 9.02,45.25 9.09,45.07 9.27,45
K_BAT on Bottom Layer: 8.15,27.5 7.97,27.58 7.89,27.76 7.89,30.66 7.82,30.84 7.64,30.91 3.56,30.91 3.38,30.84 3.3,30.66 3.3,24.16 3.38,23.98 3.56,23.91 9.4,23.91 9.47,23.78 9.4,23.66 9.4,14.28 9.59,13.74 9.91,13.26 13.46,13.26 13.78,13.74 13.97,14.28 13.97,27.25 13.75,27.44 13.46,27.5

Small or netless copper shapes (teardrops, artwork), in the pictures only: 32 on Top Layer, 9 on Bottom Layer, 121 on Inner1, 44 on Inner2

## Text on the board
Top Silkscreen Layer: BAT | GND | OFF | ON | 左键 | 中键 | 右键 | 滚轮
